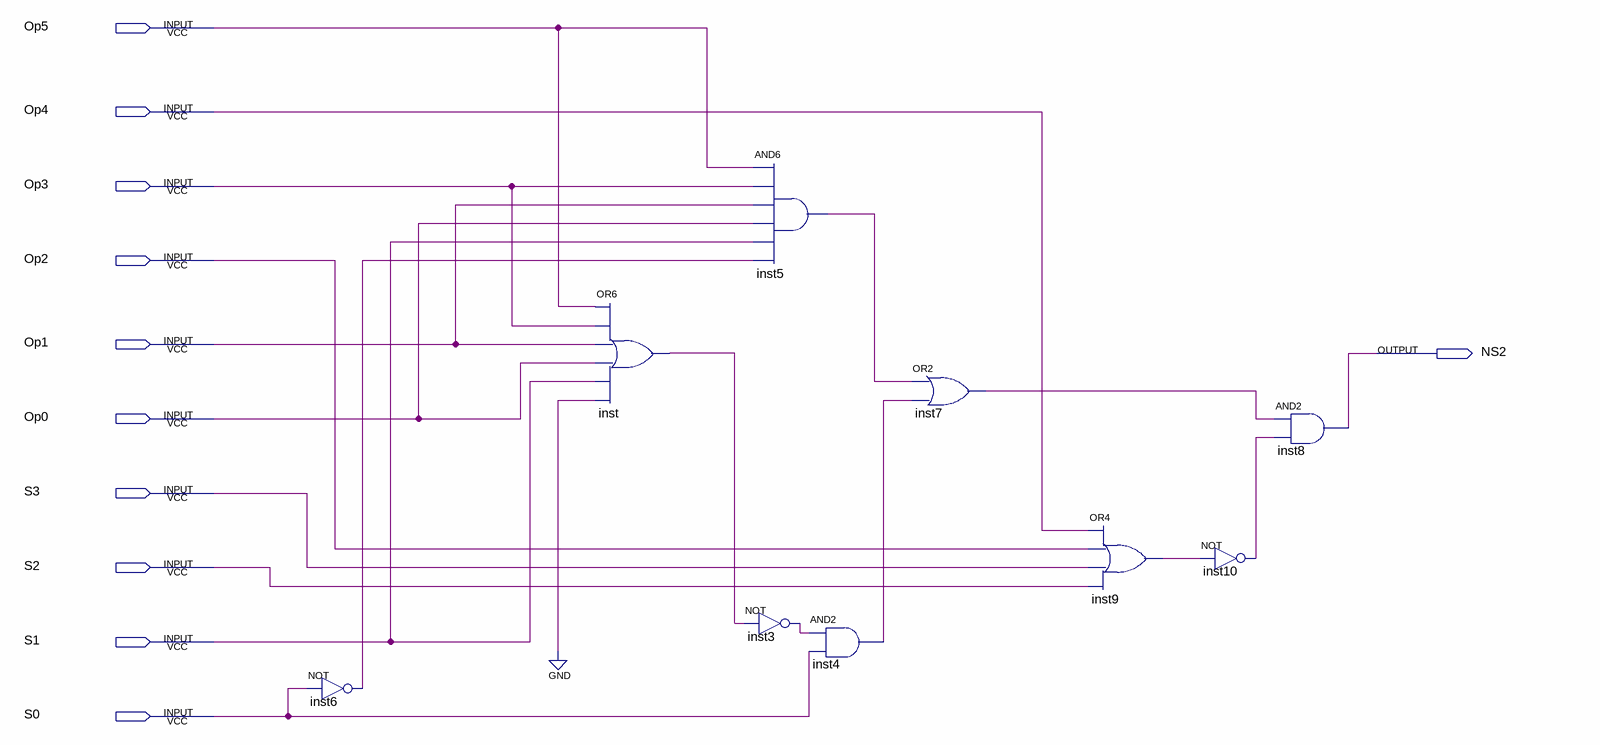
[diagram p0: schematic sheet]
// Quartus schematic NS2.bdf as structural Verilog: 9 symbols, 11 pins
module NS2 (
  input  Op5,
  input  Op4,
  input  Op3,
  input  Op2,
  input  Op1,
  input  Op0,
  input  S3,
  input  S2,
  input  S1,
  input  S0,
  output NS2
);

  wire inst3_out, inst4_out, inst5_out, inst6_out, inst7_out, inst9_out, inst10_out, inst_out;

  not inst6 (inst6_out, S0);
  or inst (inst_out, Op5, Op3, Op1, Op0, S1, 1'b0);
  and inst5 (inst5_out, Op5, Op3, Op1, Op0, S1, inst6_out);
  not inst3 (inst3_out, inst_out);
  and inst4 (inst4_out, inst3_out, S0);
  or inst7 (inst7_out, inst5_out, inst4_out);
  or inst9 (inst9_out, Op4, Op2, S3, S2);
  not inst10 (inst10_out, inst9_out);
  and inst8 (NS2, inst7_out, inst10_out);
endmodule
